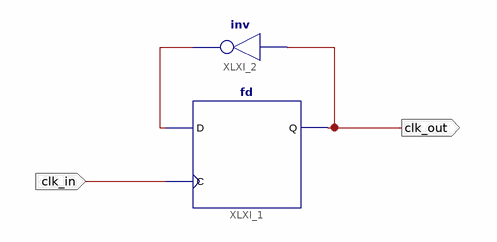
[diagram p0: schematic sheet 1]
// Xilinx ISE schematic clkDiv2.sch (spartan6) as structural Verilog: 2 symbols, 2 ports
module clkDiv2 (
  input  clk_in,
  output clk_out
);

  wire XLXN_2;

  fd XLXI_1 (.C(clk_in), .D(XLXN_2), .Q(clk_out));
  not XLXI_2 (XLXN_2, clk_out);
endmodule
